# Altium schematic sheet Linear_patch.SchDoc
size A; SheetNumber: 1; SheetTotal: 1
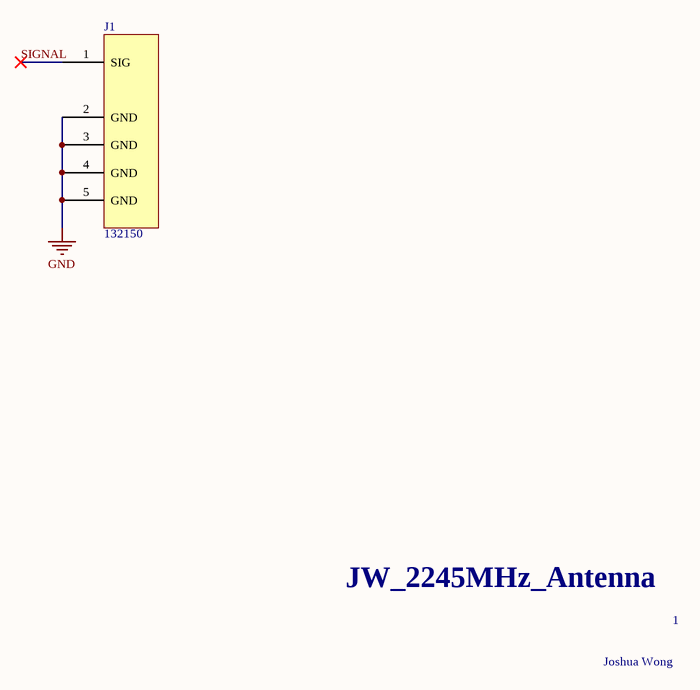
[diagram p0: Linear_patch.SchDoc]

## Parts
J1  132150  [132150-Footprint-1]

## Nets
GND: J1.2(GND) J1.3(GND) J1.4(GND) J1.5(GND)
SIGNAL: J1.1(SIG)

## Notes on the sheet
- JW_2245MHz_Antenna
- 1
- Joshua Wong

## Library data of the parts
J1 = CMP-002-00083-4: CONN SMA RCPT STR 50 OHM SOLDER; Connector Type: Coaxial, Receptacle, SMA, Socket; Gender: Female; Min Operating Temperature: -65°C; Mounting Technology: Bulkhead, Flanges, Panel; Case/Package: SMA; Max Operating Temperature: 165°C